# Altium schematic sheet Mechanicals.SchDoc: Mechanicals
size Tabloid; SheetNumber: 6; SheetTotal: 6
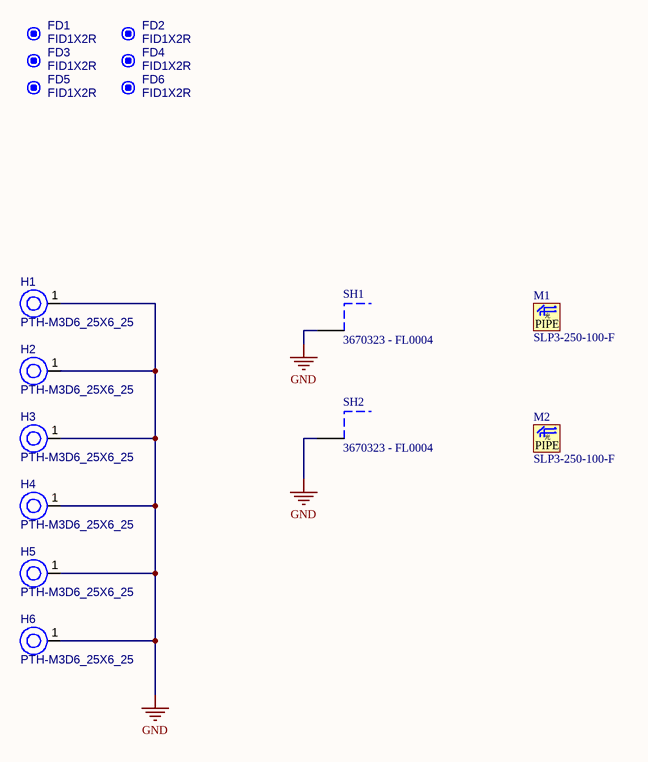
[diagram p0: Mechanicals.SchDoc]

## Parts
FD1  FID1X2R  [FID1X2R]  (no BOM)
FD2  FID1X2R  [FID1X2R]  (no BOM)
FD3  FID1X2R  [FID1X2R]  (no BOM)
FD4  FID1X2R  [FID1X2R]  (no BOM)
FD5  FID1X2R  [FID1X2R]  (no BOM)
FD6  FID1X2R  [FID1X2R]  (no BOM)
H1  PTH-M3D6_25X6_25  [PTH-M3D6_25X6_25]  (no BOM)
H2  PTH-M3D6_25X6_25  [PTH-M3D6_25X6_25]  (no BOM)
H3  PTH-M3D6_25X6_25  [PTH-M3D6_25X6_25]  (no BOM)
H4  PTH-M3D6_25X6_25  [PTH-M3D6_25X6_25]  (no BOM)
H5  PTH-M3D6_25X6_25  [PTH-M3D6_25X6_25]  (no BOM)
H6  PTH-M3D6_25X6_25  [PTH-M3D6_25X6_25]  (no BOM)
M1  SLP3-250-100-F  [BIVAR SLP3-250-100-F]
M2  SLP3-250-100-F  [BIVAR SLP3-250-100-F]
SH1  3670323 - FL0004  [3670323 - FL-0004]
SH2  3670323 - FL0004  [3670323 - FL-0004]

## Nets
GND: H1.1(H1) H2.1(H1) H3.1(H1) H4.1(H1) H5.1(H1) H6.1(H1) SH1.1 SH2.1

## Notes on the sheet
- (in symbol SLP3-250-100-F) 光; PIPE

## Library data of the parts
FD1-FD6 = CMP-00028-00005-3: Fiducial - Round 1x2mm; Pins: 0
H1-H6 = CMP-00028-00007-2: M3 PTH (3mm), 6.25mm pad; Pins: 1
M1 M2 = SLP3-250-100-F: LIGHT PIPE CLEAR 3MM LENS R/A; Manufacturer: Bivar Inc.; Configuration: Single; Lens Style: Round with Flat Top; Part Number: SLP3-250-100-F; Color: Clear; ComponentLink1Description: Datasheet; ComponentLink1URL: https://www.bivar.com/Files/Datasheets/SLP3-XXX-XXX-X.pdf; ComponentLink2Description: DigiKey Link; ComponentLink2URL: http://digikey.com/product-detail/en/bivar-inc/SLP3-250-100-F/492-1311-ND/2407221; LastUpdated: 3/20/2020 5:05:34 AM; Lens Size: 3mm; Lifecycle Status: Active; Minimum Order: 1; Mounting Type: Board Mount, Press Fit, Right Angle; Packaging: Unknown; Part Status: Active; Price: 0.59; Series: SLP-3; Supplier 1: DigiKey; Supplier Part Number 1: 492-1311-ND; Type: Rigid
SH1 SH2 = CMP-00025-00005-3: Shield Cabinet Frame, 32.3mm X 23.8mm Wurth Elektronik 3670323 - modified footprint for FL-0004